# Altium schematic sheet P12 SPI&NAND FLASH.SchDoc
size 297 x 209 mm
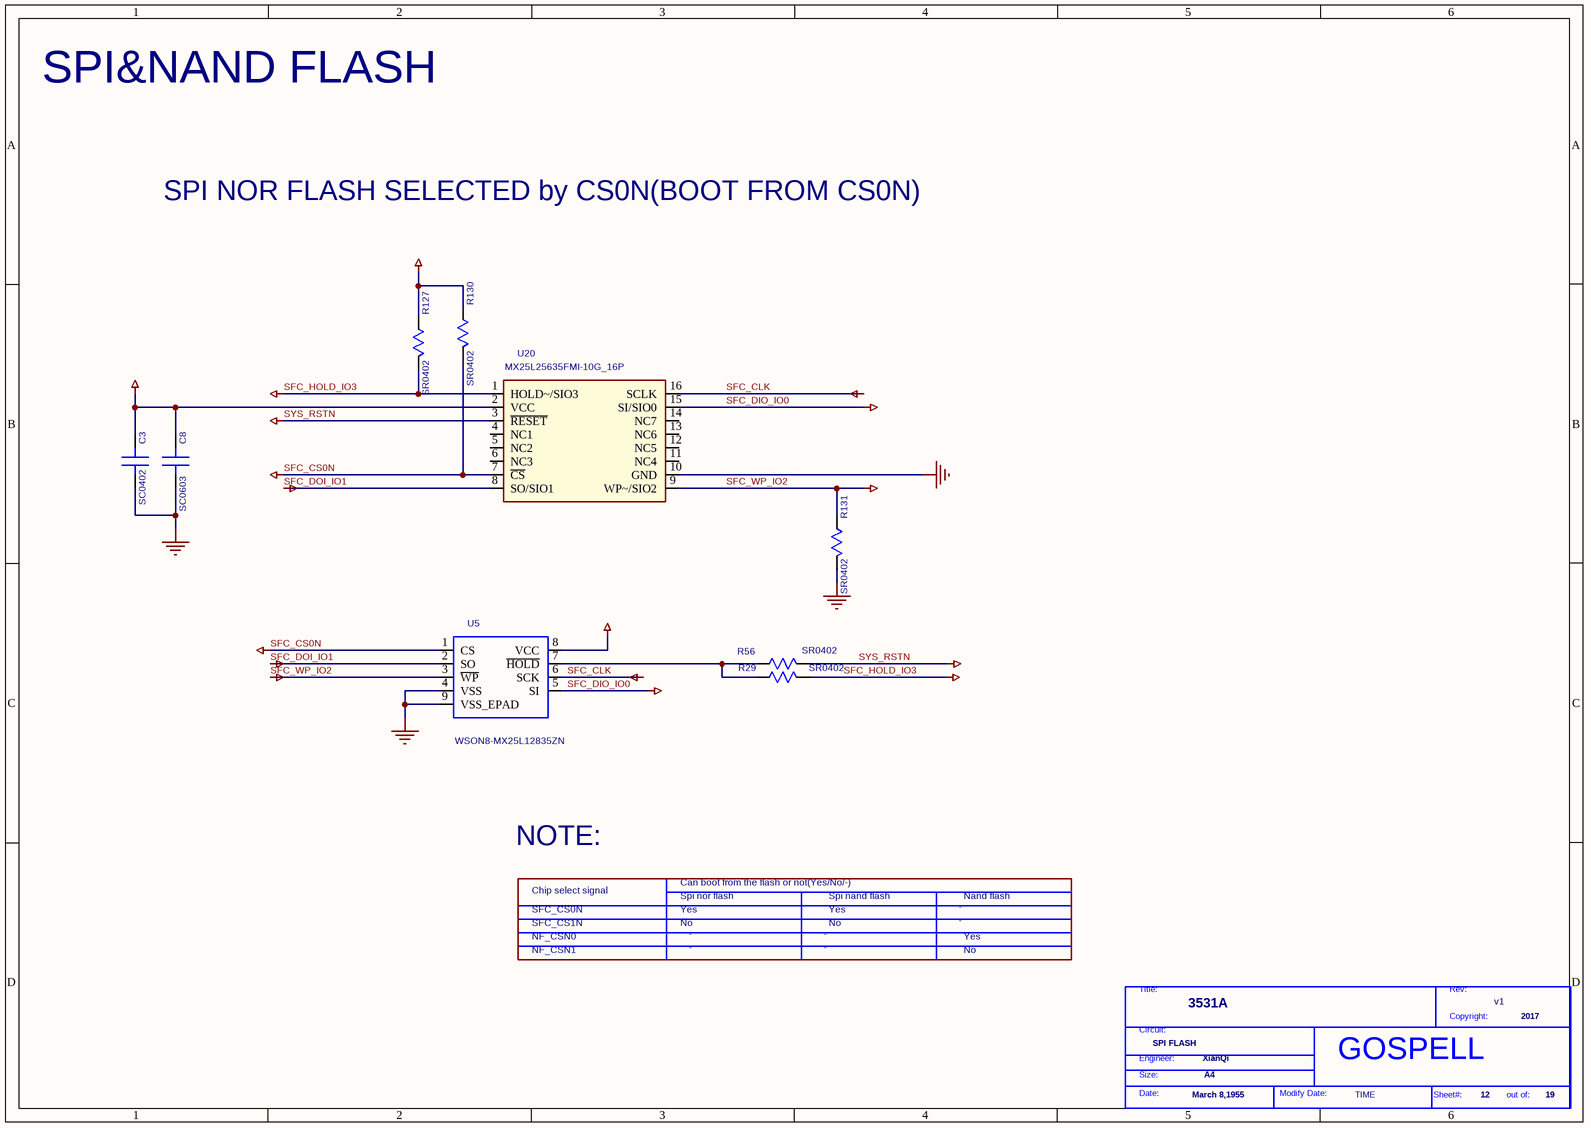
[diagram p0: P12 SPI&NAND FLASH.SchDoc]

## Parts
*  Page Modify Date: TIME  Engineer: XianQi  Copyright: 2017  Title: 3531A  RevCode: v1  Page Size: A4  Page Create Date: March 8,1955  Page Number: 12  Page Count: 19  Doc: SPI FLASH  (hidden comment: GOSPELL)  (graphical)
C3  SC0402  [SC0402]
C8  SC0603  [SC0603]
R29  SR0402  [SR0402]
R56  SR0402  [SR0402]
R127  SR0402  [SR0402]
R130  SR0402  [SR0402]
R131  SR0402  [SR0402]
U5  WSON8-MX25L12835ZN  [WSON8-MX25L12835ZN]
U20  DEVICE: MX25L25635FMI-10G_16P  [SOP16-50-300A]  (hidden comment: SOP16-50-300A)

## Nets
3V3: C3.1(A) C8.1(A) R127.1(A) R130.1(A) U5.8(VCC) U20.2(VCC)
GND: C3.2(B) C8.2(B) R131.2(B) U5.4(VSS) U5.9(VSS_EPAD) U20.10(GND)
SFC_CLK: U5.6(SCK) U20.16(SCLK)
SFC_CS0N: R130.2(B) U5.1(CS) U20.7(~{CS})
SFC_DIO_IO0: U5.5(SI) U20.15(SI/SIO0)
SFC_DOI_IO1: U5.2(SO) U20.8(SO/SIO1)
SFC_HOLD_IO3: R29.2(B) R127.2(B) U20.1(HOLD~/SIO3)
SFC_WP_IO2: R131.1(A) U5.3(~{WP}) U20.9(WP~/SIO2)
SYS_RSTN: R56.2(B) U20.3(~{RESET})
NetR29_1: R29.1(A) R56.1(A) U5.7(~{HOLD})

Not connected (* = marked no-connect by the designer): U20 4(NC1) 5(NC2) 6(NC3) 11(NC4) 12(NC5) 13(NC6) 14(NC7)

## Notes on the sheet
- SPI&NAND FLASH
- SPI NOR FLASH SELECTED by CS0N(BOOT FROM CS0N)
- NOTE:
- SFC_CS0N
- Chip select signal
- NF_CSN0
- SFC_CS1N
- Can boot from the flash or not(Yes/No/-)
- Spi nor flash
- No
- Yes
- -
- Spi nand flash
- Nand flash
- NF_CSN1
- (in symbol GOSPELL) Title:; Rev:; Copyright:; Circuit:; Engineer:; Size:; Date:; Modify Date:; Sheet#:; out of:

## Library data of the parts
C3 = C_0_Dup2: PARTS: 1; PINSWAP: (A,B); LEVEL: STD; DEVICE: RMEMK105BJ104KV_FR; OriginalSymbolOrigin: (0,30); %208%%161%%192%%224%%195%%251%%179%%198%: SMD陶瓷电容; COMPONENT_HIGH_MAX: 0.55MM; %182%%238%%182%%168%%185%%164%%215%%247%%181%%231%%209%%185%(V): 16; %195%%232%%202%%246%: SMD陶瓷电容-16V-100NF-+/-10%-X7R-0402-BT; CODE: 8070614; PKG_TYPE: SC0402
C8 = C_0_Dup1: PARTS: 1; OriginalSymbolOrigin: (0,30); DEVICE: C1608X5R0J106MT0A0E; LEVEL: STD; PINSWAP: (A,B); %208%%161%%192%%224%%195%%251%%179%%198%: SMD陶瓷电容; COMPONENT_HIGH_MAX: 0.9MM; %182%%238%%182%%168%%185%%164%%215%%247%%181%%231%%209%%185%(V): 6.3; %195%%232%%202%%246%: SMD陶瓷电容-6.3V-10000NF-+/-20%-X5R-0603-BT,TS16949; CODE: 8070649; PKG_TYPE: SC0603
R29 = R_1: PARTS: 1; LEVEL: STD; DEVICE: RC0402JR_070R; PINSWAP: (A,B); OriginalSymbolOrigin: (10,20); CODE: 7090800; %195%%232%%202%%246%: 片式厚膜电阻器-0.0625W-0OHM-< 50MOHM-0402-1A-BT; %182%%238%%182%%168%%185%%166%%194%%202%(W): 0.06; %215%%232%%214%%181%%212%%202%%208%%237%%198%%171%%178%%238%: < 50MOHM; COMPONENT_HIGH_MAX: 0.4MM; %208%%161%%192%%224%%195%%251%%179%%198%: 片式厚膜电阻器; PKG_TYPE: SR0402
R56 = R_1: PARTS: 1; LEVEL: STD; DEVICE: RC0402JR_070R; PINSWAP: (A,B); OriginalSymbolOrigin: (10,20); %208%%161%%192%%224%%195%%251%%179%%198%: 片式厚膜电阻器; COMPONENT_HIGH_MAX: 0.4MM; %215%%232%%214%%181%%212%%202%%208%%237%%198%%171%%178%%238%: < 50MOHM; %182%%238%%182%%168%%185%%166%%194%%202%(W): 0.06; %195%%232%%202%%246%: 片式厚膜电阻器-0.0625W-0OHM-< 50MOHM-0402-1A-BT; CODE: 7090800; PKG_TYPE: SR0402
R127 R130 R131 = R_1: PARTS: 1; LEVEL: STD; DEVICE: RK73B1ELTP472J; PINSWAP: (A,B); OriginalSymbolOrigin: (10,20); %208%%161%%192%%224%%195%%251%%179%%198%: 片式厚膜电阻器; COMPONENT_HIGH_MAX: 0.4MM; %215%%232%%214%%181%%212%%202%%208%%237%%198%%171%%178%%238%: +/-5%; %182%%238%%182%%168%%185%%166%%194%%202%(W): 0.06; %195%%232%%202%%246%: 片式厚膜电阻器-0.0625W-4700OHM-+/-5%-0402-BT; CODE: 7090793; PKG_TYPE: SR0402
U5 = SPI_NAND_FLASH_0: PARTS: 1; DEVICE: 8PIN_SPI_FLASH; LEVEL: STD; OriginalSymbolOrigin: (20,70); %195%%232%%202%%246%: SPI NAND FLASH-2GBIT-GD5F2GQ4UAYIG; CODE: 36DM0U9A; PKG_TYPE: WSON8-MX25L12835ZN
U20 = MX25L25635EMI-12G_1: PARTS: 1; LEVEL: STD; OriginalSymbolOrigin: (10,100); CODE: HBVT3001; %195%%232%%202%%246%: SPI FLASH-256MBIT-50MHZ-64KB-3.3V-SOP16L-00425847; COMPONENT_HIGH_MAX: 2.65MM; PKG_TYPE: SOP16-50-300A